# Altium project BASE-B.PrjPCB
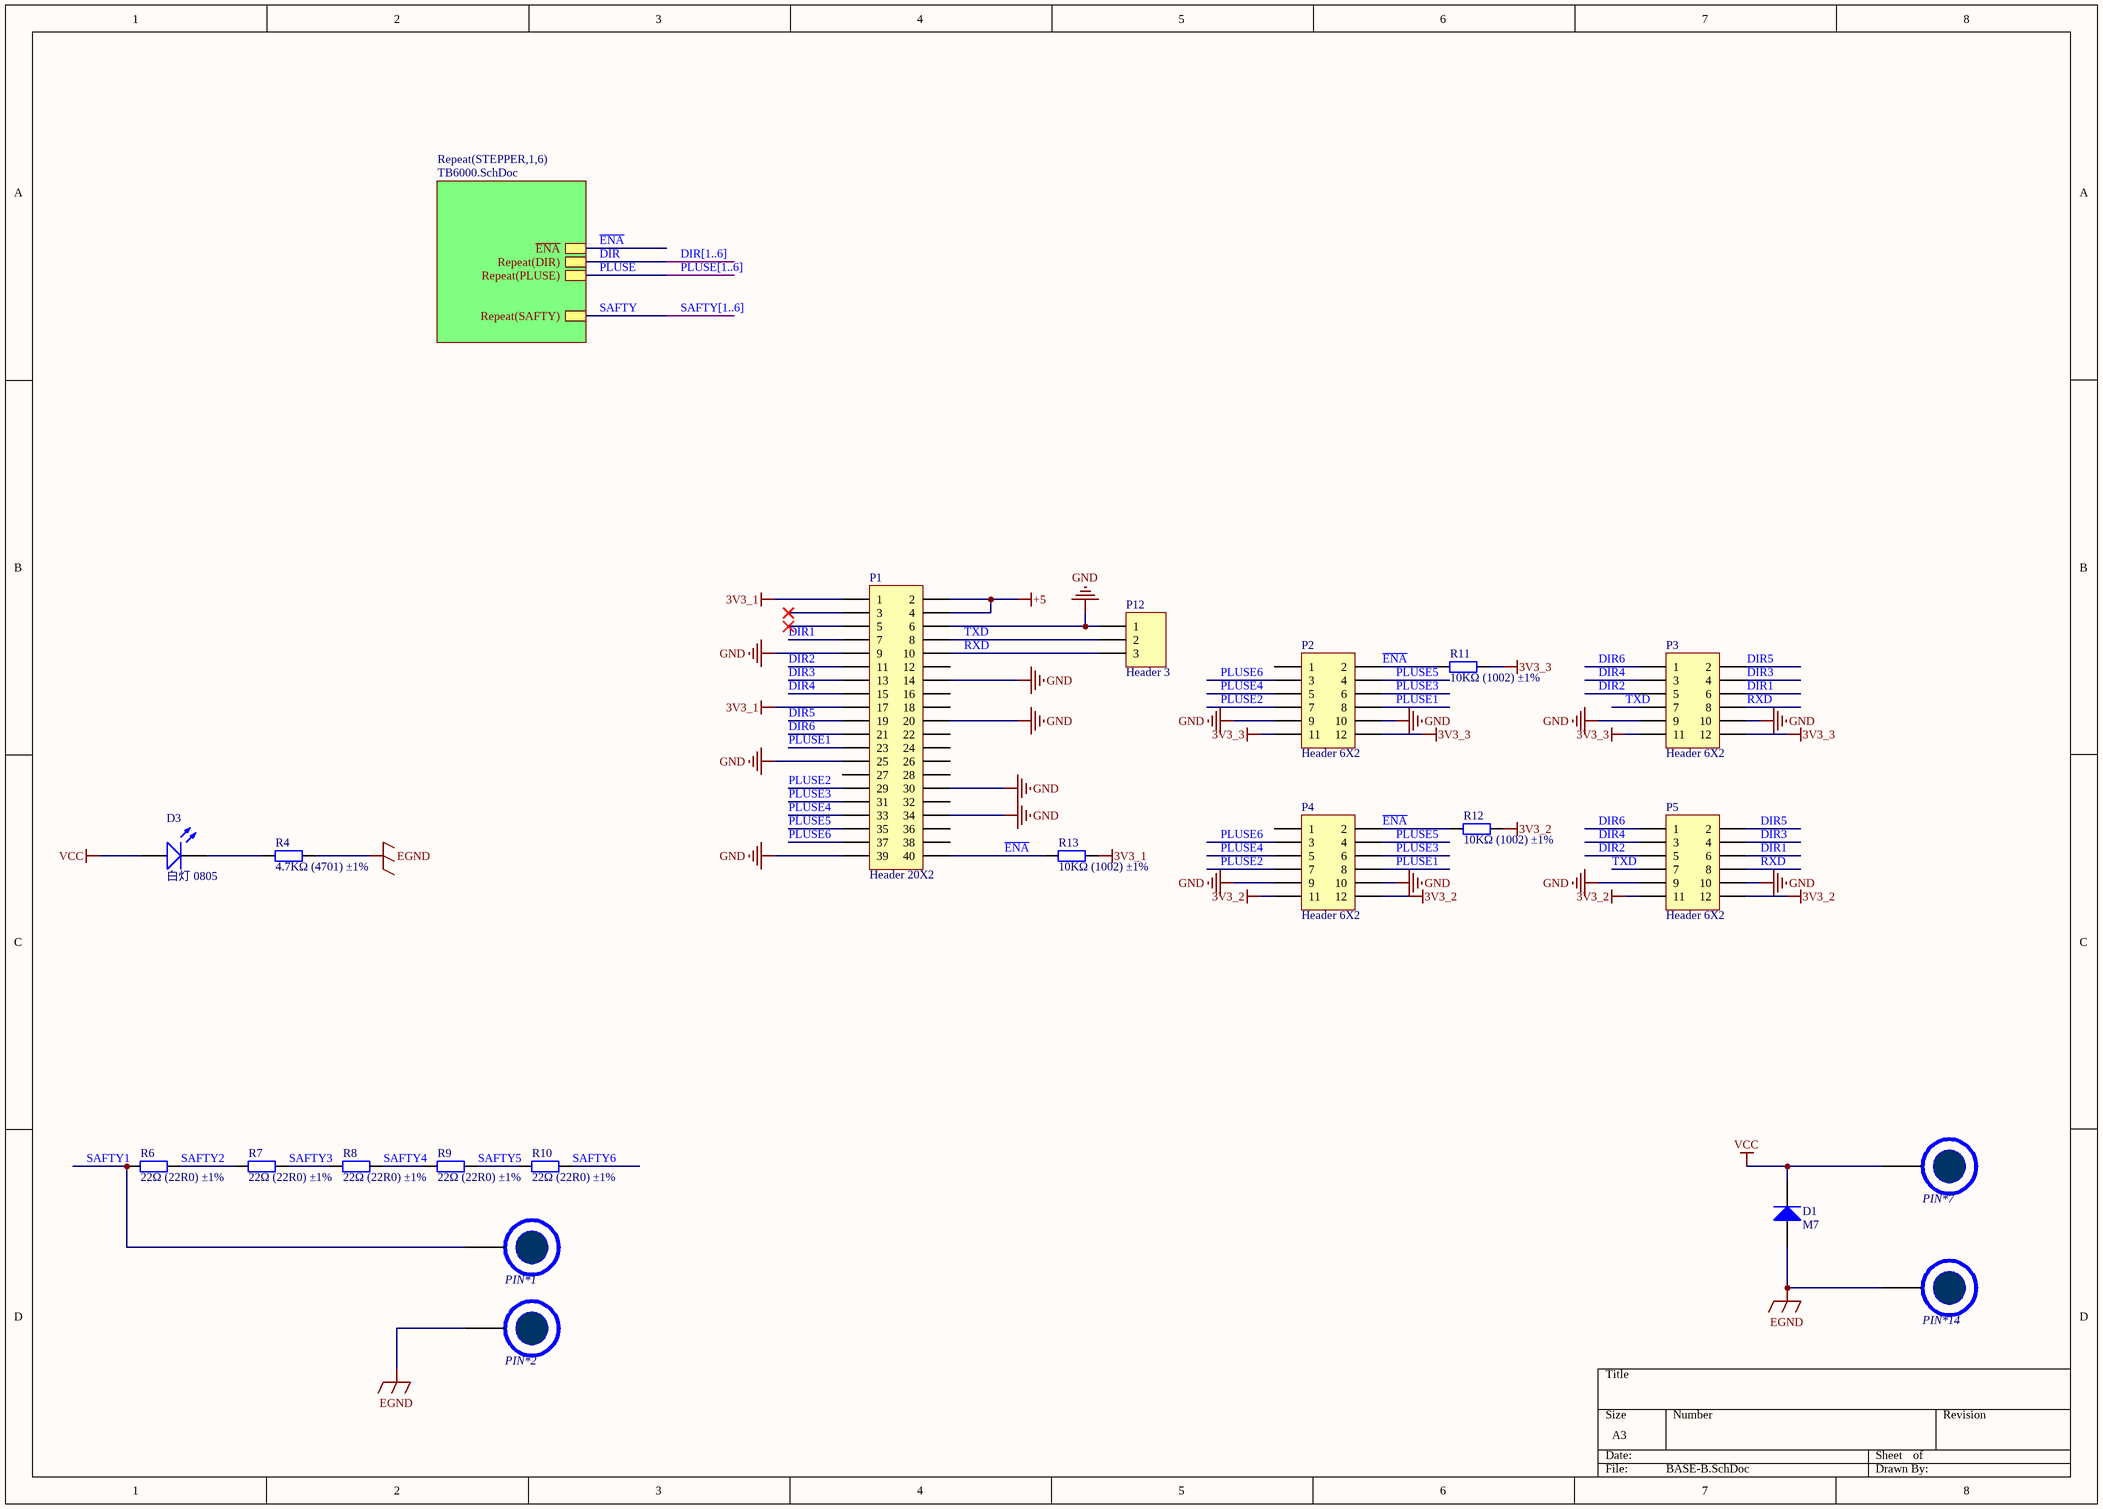
[diagram p0: BASE-B.SchDoc]
2 sheets, 129 parts. Net scope: hierarchical (ports join the sheet entries above them; power ports are global).
Board file: TB6600_Base.PcbDoc
Sheets:
  BASE-B.SchDoc
    STEPPER1 = TB6000.SchDoc
    STEPPER2 = TB6000.SchDoc
    STEPPER3 = TB6000.SchDoc
    STEPPER4 = TB6000.SchDoc
    STEPPER5 = TB6000.SchDoc
    STEPPER6 = TB6000.SchDoc

## Sheet BASE-B.SchDoc
size A3

### Parts
D1  M7  [SMA(DO-214AC)_S1]
D3  白灯 0805  [0805_LED_S1]
P1  Header 20X2  [HDR2X20]
P2  Header 6X2  [HDR2X6]
P3  Header 6X2  [HDR2X6]
P4  Header 6X2  [HDR2X6]
P5  Header 6X2  [HDR2X6]
P12  Header 3  [HDR1X3]
PIN*1  PIN  [PIN]  (value not drawn)
PIN*2  PIN  [PIN]  (value not drawn)
PIN*7  PIN  [PIN]  (value not drawn)
PIN*14  PIN  [PIN]  (value not drawn)
R4  4.7KΩ (4701) ±1%  [1206_R]
R6  22Ω (22R0) ±1%  [1206_R]
R7  22Ω (22R0) ±1%  [1206_R]
R8  22Ω (22R0) ±1%  [1206_R]
R9  22Ω (22R0) ±1%  [1206_R]
R10  22Ω (22R0) ±1%  [1206_R]
R11  10KΩ (1002) ±1%  [1206_R]
R12  10KΩ (1002) ±1%  [1206_R]
R13  10KΩ (1002) ±1%  [1206_R]

### Sub-sheets
Repeat(STEPPER,1,6) = TB6000.SchDoc: ~{ENA}, Repeat(DIR), Repeat(PLUSE), Repeat(SAFTY)

### Nets
3V3_1: P1.1 P1.17 R13.2
3V3_2: P4.11 P4.12 P5.11 P5.12 R12.2
3V3_3: P2.11 P2.12 P3.11 P3.12 R11.2
+5: P1.2 P1.4
EGND: D1.1(A) PIN*2.1(PIN) PIN*14.1(PIN) R4.2
GND: P1.6 P1.9 P1.14 P1.20 P1.25 P1.30 P1.34 P1.39 P2.9 P2.10 P3.9 P3.10 P4.9 P4.10 P5.9 P5.10 P12.1
VCC: D1.2(K) D3.A PIN*7.1(PIN)
DIR: sheet Repeat(STEPPER,1,6)/Repeat(DIR)
DIR1: P1.7 P3.6 P5.6  [project net DIR]
DIR2: P1.11 P3.5 P5.5  [project net DIR]
DIR3: P1.13 P3.4 P5.4  [project net DIR]
DIR4: P1.15 P3.3 P5.3  [project net DIR]
DIR5: P1.19 P3.2 P5.2  [project net DIR]
DIR6: P1.21 P3.1 P5.1  [project net DIR]
~{ENA}: P1.40 P2.2 P4.2 R11.1 R12.1 R13.1 ; sheet Repeat(STEPPER,1,6)/~{ENA}
PLUSE: sheet Repeat(STEPPER,1,6)/Repeat(PLUSE)
PLUSE1: P1.23 P2.8 P4.8  [project net PLUSE]
PLUSE2: P1.29 P2.7 P4.7  [project net PLUSE]
PLUSE3: P1.31 P2.6 P4.6  [project net PLUSE]
PLUSE4: P1.33 P2.5 P4.5  [project net PLUSE]
PLUSE5: P1.35 P2.4 P4.4  [project net PLUSE]
PLUSE6: P1.37 P2.3 P4.3  [project net PLUSE]
RXD: P1.10 P3.8 P5.8 P12.3
SAFTY: sheet Repeat(STEPPER,1,6)/Repeat(SAFTY)
SAFTY1: PIN*1.1(PIN) R6.1  [project net SAFTY]
SAFTY2: R6.2 R7.1  [project net SAFTY]
SAFTY3: R7.2 R8.1  [project net SAFTY]
SAFTY4: R8.2 R9.1  [project net SAFTY]
SAFTY5: R9.2 R10.1  [project net SAFTY]
SAFTY6: R10.2  [project net SAFTY]
TXD: P1.8 P3.7 P5.7 P12.2
NetD3_K: D3.K R4.1

Not connected (* = marked no-connect by the designer): P1 3* 5* 12 16 18 22 24 26 27 28 32 36 38; P2 1; P4 1

### Buses and harness runs
bus DIR[1..6]
bus PLUSE[1..6]
bus SAFTY[1..6]

### Library data of the parts
D1 = SMA(DO-214AC) M7: 二极管; 备注: 1N4007 4007 编号C2464 已经停售, 使用新物料编号C95872; ComponentLink1Description: 供应商链接; ComponentLink1URL: http://www.szlcsc.com/product/details_2841.html; Package: SMA(DO-214AC); Supplier: LC; SuppliersPartNumber: C95872
D3 = 0805 白灯: 发光二极管; ComponentLink1Description: 供应商链接; ComponentLink1URL: http://www.szlcsc.com/product/details_35468.html; Package: 0805; Supplier: LC; SuppliersPartNumber: C34499
P1 = Header 20X2: Header, 20-Pin, Dual row; LatestRevisionDate: 17-Jul-2002; LatestRevisionNote: Re-released for DXP Platform.; Publisher: Altium Limited
P2-P5 = Header 6X2: Header, 6-Pin, Dual row; LatestRevisionDate: 17-Jul-2002; LatestRevisionNote: Re-released for DXP Platform.; Publisher: Altium Limited
P12 = Header 3: Header, 3-Pin; LatestRevisionDate: 17-Jul-2002; LatestRevisionNote: Re-released for DXP Platform.; Publisher: Altium Limited
R4 = 1206 4.7KΩ (4701) 1%: 贴片电阻; ComponentLink1Description: 供应商链接; ComponentLink1URL: http://www.szlcsc.com/product/details_18624.html; Package: 1206; Supplier: LC; SuppliersPartNumber: C17936
R6-R10 = 1206 22Ω (22R0) 1%: 贴片电阻; ComponentLink1Description: 供应商链接; ComponentLink1URL: http://www.szlcsc.com/product/details_18646.html; Package: 1206; Supplier: LC; SuppliersPartNumber: C17958
R11-R13 = 1206 10KΩ (1002) 1%: 贴片电阻; ComponentLink1Description: 供应商链接; ComponentLink1URL: http://www.szlcsc.com/product/details_18590.html; Package: 1206; Supplier: LC; SuppliersPartNumber: C17902

## Sheet TB6000.SchDoc
size A3
Used 6 times, as channels STEPPER1, STEPPER2, STEPPER3, STEPPER4, STEPPER5, STEPPER6. Parts and nets are listed once, with the designators drawn on the sheet.
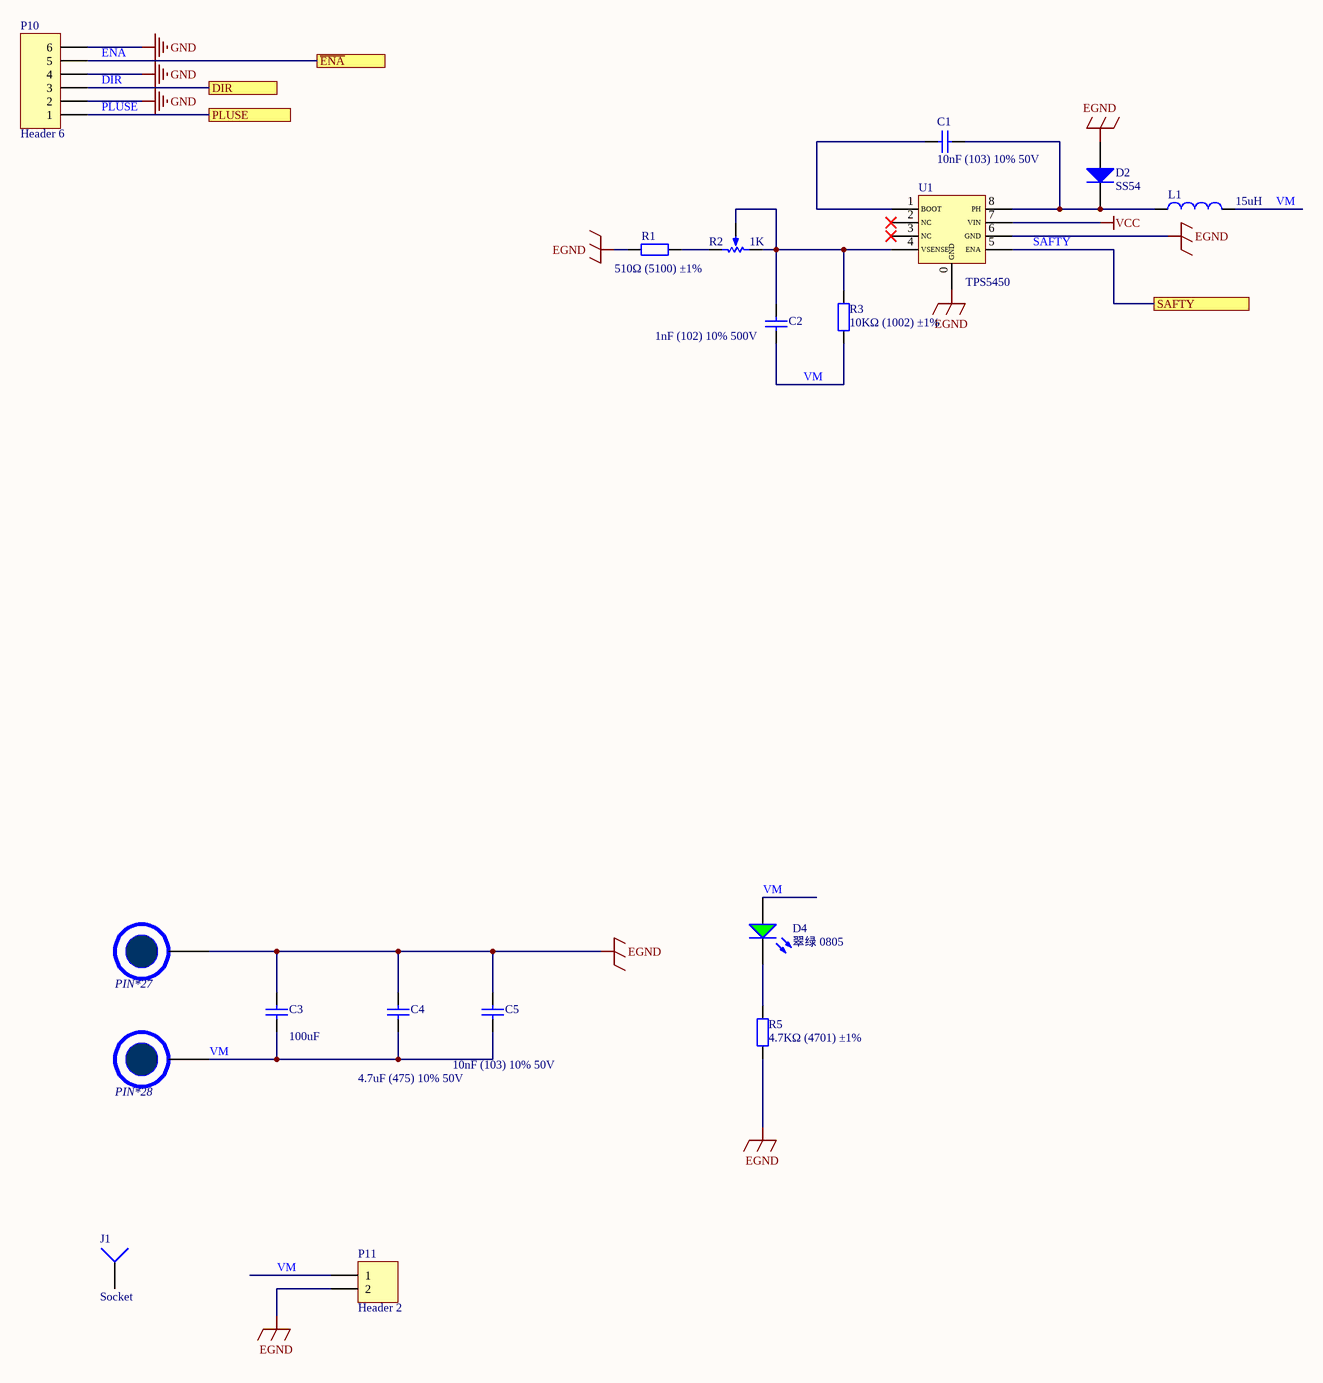
[diagram p1: TB6000.SchDoc]

### Parts
C1  10nF (103) 10% 50V  [1206_C]
C2  1nF (102) 10% 500V  [1206_C]
C3  value 100uF  [C100uF]  (hidden comment: Cap)
C4  4.7uF (475) 10% 50V  [1206_C]
C5  10nF (103) 10% 50V  [1206_C]
D2  SS54  [SMA(DO-214AC)_S1]
D4  翠绿 0805  [0805_LED_S1]
J1  Socket  [PCBComponent_1]
L1  value 15uH  [INDP175172X70M]  (hidden comment: Inductor)
P10  Header 6  [HDR1X6]
P11  Header 2  [HDR1X2]
PIN*27  PIN  [PIN]  (value not drawn)
PIN*28  PIN  [PIN]  (value not drawn)
R1  510Ω (5100) ±1%  [0805_R]
R2  value 1K  [RP1]  (hidden comment: RPot)
R3  10KΩ (1002) ±1%  [1206_R]
R5  4.7KΩ (4701) ±1%  [1206_R]
U1  TPS5450  [LC-SOP-8_EP_150mil]

### Ports
DIR, PLUSE, SAFTY, ~{ENA}

### Nets
EGND: C3.2 C4.2 C5.2 D2.1(A) P11.2 PIN*27.1(PIN) R1.1 R5.2 U1.0(GND) U1.6(GND)
GND: P10.2 P10.4 P10.6
VCC: U1.7(VIN)
DIR: P10.3 ; port DIR
~{ENA}: P10.5 ; port ~{ENA}
PLUSE: P10.1 ; port PLUSE
SAFTY: U1.5(ENA) ; port SAFTY
VM: C2.1 C3.1 C4.1 C5.1 D4.A L1.2 P11.1 PIN*28.1(PIN) R3.1
NetC1_1: C1.1 U1.1(BOOT)
NetC1_2: C1.2 D2.2(K) L1.1 U1.8(PH)
NetC2_2: C2.2 R2.2(TAP) R2.3(BOT) R3.2 U1.4(VSENSE)
NetD4_K: D4.K R5.1
NetR1_2: R1.2 R2.1(TOP)

Not connected (* = marked no-connect by the designer): J1 1; U1 2(NC)* 3(NC)*

### Channels
STEPPER1: designators end in _STEPPER1; ports DIR=DIR PLUSE=PLUSE SAFTY=SAFTY ~{ENA}=~{ENA}
STEPPER2: designators end in _STEPPER2; ports DIR=DIR PLUSE=PLUSE SAFTY=SAFTY ~{ENA}=~{ENA}
STEPPER3: designators end in _STEPPER3; ports DIR=DIR PLUSE=PLUSE SAFTY=SAFTY ~{ENA}=~{ENA}
STEPPER4: designators end in _STEPPER4; ports DIR=DIR PLUSE=PLUSE SAFTY=SAFTY ~{ENA}=~{ENA}
STEPPER5: designators end in _STEPPER5; ports DIR=DIR PLUSE=PLUSE SAFTY=SAFTY ~{ENA}=~{ENA}
STEPPER6: designators end in _STEPPER6; ports DIR=DIR PLUSE=PLUSE SAFTY=SAFTY ~{ENA}=~{ENA}

### Library data of the parts
C1 C5 = 1206 10nF (103) 10% 50V: 贴片电容; ComponentLink1Description: 供应商链接; ComponentLink1URL: http://www.szlcsc.com/product/details_2198.html; Package: 1206; Supplier: LC; SuppliersPartNumber: C1846
C2 = 1206 1nF (102) 10% 500V: 贴片电容; ComponentLink1Description: 供应商链接; ComponentLink1URL: http://www.szlcsc.com/product/details_36187.html; Package: 1206; Supplier: LC; SuppliersPartNumber: C35216
C3 = Cap: 贴片电容; Published: 8-Jun-2000; LatestRevisionDate: 17-Jul-2002; LatestRevisionNote: Re-released for DXP Platform.; PackageReference: RAD-0.3; Publisher: Altium Limited
C4 = 1206 4.7uF (475) 10% 50V: 贴片电容; ComponentLink1Description: 供应商链接; ComponentLink1URL: http://www.szlcsc.com/product/details_30577.html; Package: 1206; Supplier: LC; SuppliersPartNumber: C29823
D2 = SMA(DO-214AC) SS54: 二极管; ComponentLink1Description: 供应商链接; ComponentLink1URL: http://www.szlcsc.com/product/details_23178.html; Package: SMA(DO-214AC); Supplier: LC; SuppliersPartNumber: C22452
D4 = 0805 翠绿: 发光二极管; ComponentLink1Description: 供应商链接; ComponentLink1URL: http://www.szlcsc.com/product/details_2670.html; Package: 0805; Supplier: LC; SuppliersPartNumber: C2297
L1 = Inductor: Code_IEC: 1005; Published: 8-Jun-2000; LatestRevisionDate: 29-May-2009; LatestRevisionNote: IPC-7351 Footprint Added.; PackageReference: 0402-A; Publisher: Altium Limited; PackageDescription: Chip Inductor; Code_JEITA: 0402
P10 = Header 6: Header, 6-Pin; LatestRevisionDate: 17-Jul-2002; LatestRevisionNote: Re-released for DXP Platform.; Publisher: Altium Limited
P11 = Header 2: Header, 2-Pin; LatestRevisionDate: 17-Jul-2002; LatestRevisionNote: Re-released for DXP Platform.; Publisher: Altium Limited
R1 = 0805 510Ω (5100) 1%: 贴片电阻; ComponentLink1Description: 供应商链接; ComponentLink1URL: http://www.szlcsc.com/product/details_18422.html; Package: 0805; Supplier: LC; SuppliersPartNumber: C17734
R2 = RPot: 电位器; Sim Note: Enter the Resistance value and the set point into parameter fields.; Set Position: 0.5; Published: 8-Jun-2000; LatestRevisionDate: 17-Jul-2002; LatestRevisionNote: Re-released for DXP Platform.; PackageReference: VR5; Publisher: Altium Limited
R3 = 1206 10KΩ (1002) 1%: 贴片电阻; ComponentLink1Description: 供应商链接; ComponentLink1URL: http://www.szlcsc.com/product/details_18590.html; Package: 1206; Supplier: LC; SuppliersPartNumber: C17902
R5 = 1206 4.7KΩ (4701) 1%: 贴片电阻; ComponentLink1Description: 供应商链接; ComponentLink1URL: http://www.szlcsc.com/product/details_18624.html; Package: 1206; Supplier: LC; SuppliersPartNumber: C17936
J1 = Socket: LatestRevisionDate: 17-Jul-2002; LatestRevisionNote: Re-released for DXP Platform.; Publisher: Altium Limited

## Nets that join several sheets
EGND: BASE-B (D1.1 PIN*2.1 PIN*14.1 R4.2), STEPPER1 (10 pins), STEPPER2 (10 pins), STEPPER3 (10 pins), STEPPER4 (10 pins), STEPPER5 (10 pins), STEPPER6 (10 pins)
GND: BASE-B (17 pins), STEPPER1 (P10_STEPPER1.2 P10_STEPPER1.4 P10_STEPPER1.6), STEPPER2 (P10_STEPPER2.2 P10_STEPPER2.4 P10_STEPPER2.6), STEPPER3 (P10_STEPPER3.2 P10_STEPPER3.4 P10_STEPPER3.6), STEPPER4 (P10_STEPPER4.2 P10_STEPPER4.4 P10_STEPPER4.6), STEPPER5 (P10_STEPPER5.2 P10_STEPPER5.4 P10_STEPPER5.6), STEPPER6 (P10_STEPPER6.2 P10_STEPPER6.4 P10_STEPPER6.6)
VCC: BASE-B (D1.2 D3.A PIN*7.1), STEPPER1 (U1_STEPPER1.7), STEPPER2 (U1_STEPPER2.7), STEPPER3 (U1_STEPPER3.7), STEPPER4 (U1_STEPPER4.7), STEPPER5 (U1_STEPPER5.7), STEPPER6 (U1_STEPPER6.7)
DIR: BASE-B (P1.7 P3.6 P5.6), STEPPER1 (P10_STEPPER1.3)
DIR: BASE-B (P1.11 P3.5 P5.5), STEPPER2 (P10_STEPPER2.3)
DIR: BASE-B (P1.13 P3.4 P5.4), STEPPER3 (P10_STEPPER3.3)
DIR: BASE-B (P1.15 P3.3 P5.3), STEPPER4 (P10_STEPPER4.3)
DIR: BASE-B (P1.19 P3.2 P5.2), STEPPER5 (P10_STEPPER5.3)
DIR: BASE-B (P1.21 P3.1 P5.1), STEPPER6 (P10_STEPPER6.3)
~{ENA}: BASE-B (6 pins), STEPPER1 (P10_STEPPER1.5), STEPPER2 (P10_STEPPER2.5), STEPPER3 (P10_STEPPER3.5), STEPPER4 (P10_STEPPER4.5), STEPPER5 (P10_STEPPER5.5), STEPPER6 (P10_STEPPER6.5)
PLUSE: BASE-B (P1.23 P2.8 P4.8), STEPPER1 (P10_STEPPER1.1)
PLUSE: BASE-B (P1.29 P2.7 P4.7), STEPPER2 (P10_STEPPER2.1)
PLUSE: BASE-B (P1.31 P2.6 P4.6), STEPPER3 (P10_STEPPER3.1)
PLUSE: BASE-B (P1.33 P2.5 P4.5), STEPPER4 (P10_STEPPER4.1)
PLUSE: BASE-B (P1.35 P2.4 P4.4), STEPPER5 (P10_STEPPER5.1)
PLUSE: BASE-B (P1.37 P2.3 P4.3), STEPPER6 (P10_STEPPER6.1)
SAFTY: BASE-B (R6.2 R7.1), STEPPER2 (U1_STEPPER2.5)
SAFTY: BASE-B (PIN*1.1 R6.1), STEPPER1 (U1_STEPPER1.5)
SAFTY: BASE-B (R7.2 R8.1), STEPPER3 (U1_STEPPER3.5)
SAFTY: BASE-B (R8.2 R9.1), STEPPER4 (U1_STEPPER4.5)
SAFTY: BASE-B (R9.2 R10.1), STEPPER5 (U1_STEPPER5.5)
SAFTY: BASE-B (R10.2), STEPPER6 (U1_STEPPER6.5)